# EAGLE design pwm (EAGLE 6.1)
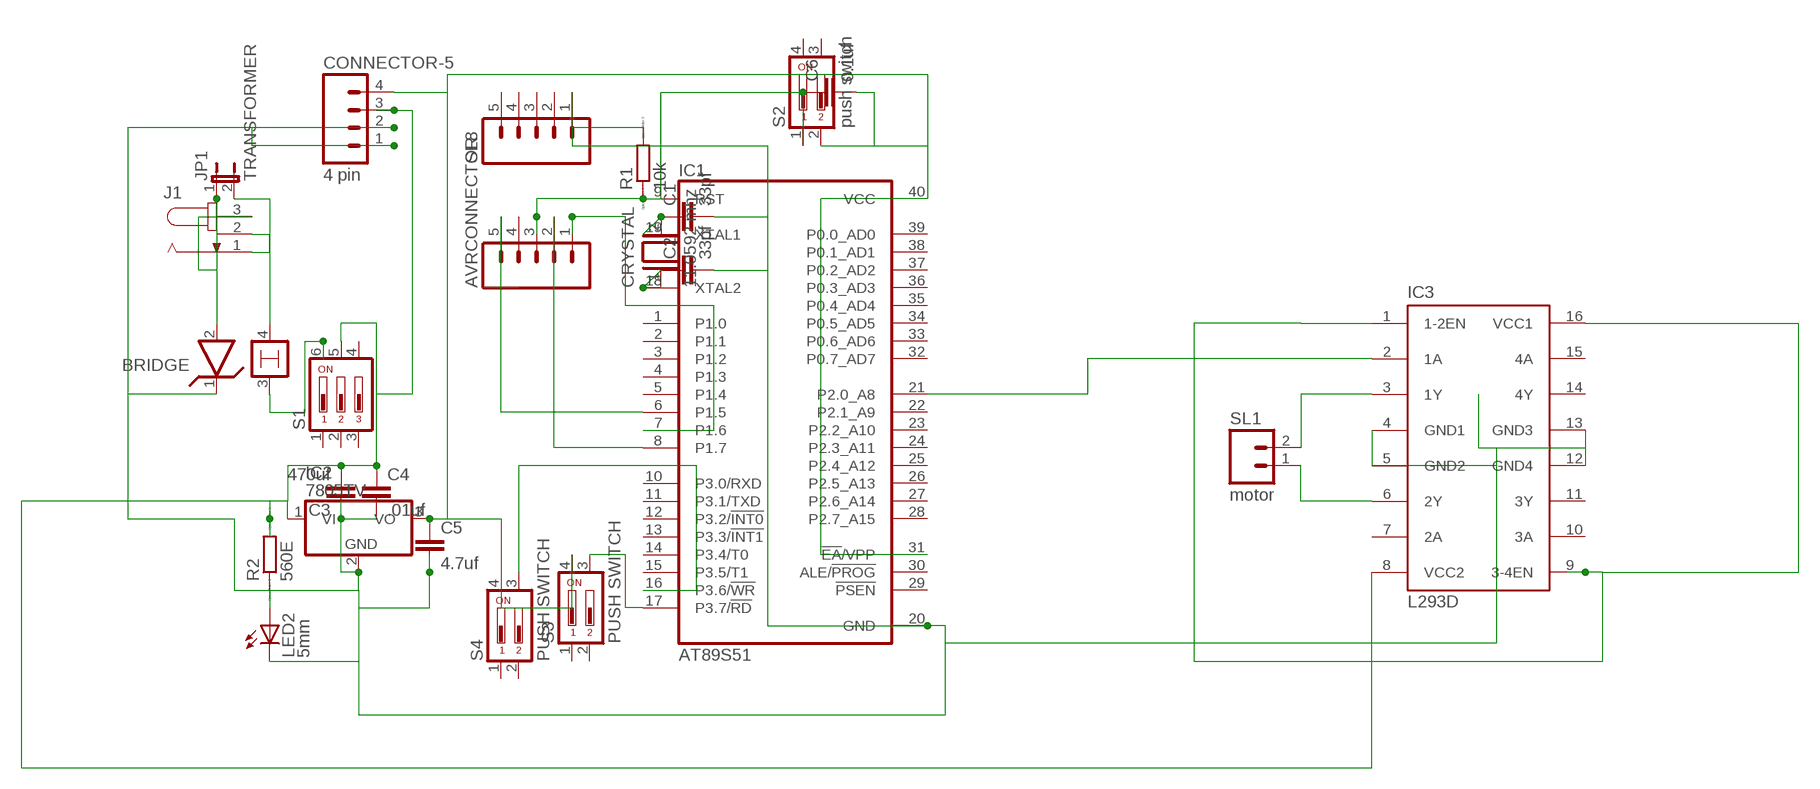
[diagram p0: schematic, sheet 1]

## Parts
AVRCONNECTOR  M05  [05P]
BRIDGE  LM399H  [TO39/4]
C1  33pf  C-EU025-024X044  [C025-024X044]
C2  33pf  C-EU025-024X044  [C025-024X044]
C3  470uf  C5/7.2  [C5B7.2]
C4  .01uf  C2,5-3  [C2.5-3]
C5  4.7uf  C2,5-3  [C2.5-3]
C6  0.1uf  C2,5-3  [C2.5-3]
CONNECTOR-5  4 pin  M04  [04P]
CRYSTAL  11.0592 mhz  XTAL/S  [QS]
IC1  AT89S51  AT89C51-12PC  [DIL40]
IC2  7805TV  [TO220V]
IC3  L293D  [DIL16]
J1  JACK-PLUG0  [SPC4077]
JP1  TRANSFORMER  JP1E  [JP1]
LED2  5mm  LED5MM  [LED5MM]
R1  10k  R0204/7  [0204/7]
R2  560E  R0204/7  [0204/7]
S1  DA03  [DA-03]
S2  push switch  DP02  [DP-02]
S3  PUSH SWITCH  DS02  [DS-02]
S4  PUSH SWITCH  DS02  [DS-02]
SL1  motor  M02  [02P]
SL8  M05  [05P]

## Nets
N$1: C2.1 CRYSTAL.1 IC1.18(XTAL2)
N$2: C1.1 CRYSTAL.2 IC1.19(XTAL1)
N$3: IC1.17(P3.7/!RD) S3.3
N$4: C3.2 C4.1 CONNECTOR-5.3 IC2.1(VI) IC3.8(VCC2) R2.2 S1.5
N$5: BRIDGE.2 J1.3 JP1.1
N$6: IC3.6(2Y) SL1.1
N$7: IC3.3(1Y) SL1.2
N$8: BRIDGE.1 CONNECTOR-5.1 CONNECTOR-5.2
N$9: IC1.16(P3.6/!WR) S4.3
N$14: AVRCONNECTOR.3 C6.1 IC1.9(RST) R1.1 S2.1
N$15: AVRCONNECTOR.1 IC1.7(P1.6)
N$16: BRIDGE.4 J1.1 J1.2 JP1.2
N$21: C1.2 C2.2 C3.1 C4.2 C5.2 IC1.20(GND) IC2.2(GND) IC3.4(GND1) IC3.5(GND2) IC3.12(GND4) IC3.13(GND3) LED2.K(C) R1.2 SL8.1
N$22: IC3.1(1-2EN) IC3.9(3-4EN) IC3.16(VCC1)
N$30: IC1.21(P2.0_A8) IC3.2(1A)
N$39: C5.1 C6.2 CONNECTOR-5.4 IC1.31(!EA!/VPP) IC1.40(VCC) IC2.3(VO) S2.2 S3.4 S4.4
N$42: AVRCONNECTOR.5 IC1.6(P1.5)
N$43: LED2.A R2.1
N$45: AVRCONNECTOR.2 IC1.8(P1.7)
N$47: BRIDGE.3 S1.6
Unconnected: AVRCONNECTOR.4 IC1.1(P1.0) IC1.2(P1.1) IC1.3(P1.2) IC1.4(P1.3) IC1.5(P1.4) IC1.10(P3.0/RXD) IC1.11(P3.1/TXD) IC1.12(P3.2/!INT0) IC1.13(P3.3/!INT1) IC1.14(P3.4/T0) IC1.15(P3.5/T1) IC1.22(P2.1_A9) IC1.23(P2.2_A10) IC1.24(P2.3_A11) IC1.25(P2.4_A12) IC1.26(P2.5_A13) IC1.27(P2.6_A14) IC1.28(P2.7_A15) IC1.29(!PSEN) IC1.30(ALE/!PROG) IC1.32(P0.7_AD7) IC1.33(P0.6_AD6) IC1.34(P0.5_AD5) IC1.35(P0.4_AD4) IC1.36(P0.3_AD3) IC1.37(P0.2_AD2) IC1.38(P0.1_AD1) IC1.39(P0.0_AD0) IC3.7(2A) IC3.10(3A) IC3.11(3Y) IC3.14(4Y) IC3.15(4A) S1.1 S1.2 S1.3 S1.4 S2.3 S2.4 S3.1 S3.2 S4.1 S4.2 SL8.2 SL8.3 SL8.4 SL8.5

## Library data of the parts
AVRCONNECTOR SL8 = con-amp-quick:M05: AMP QUICK CONNECTOR; OC_FARNELL: unknown; OC_NEWARK: unknown
BRIDGE = linear:LM399H: Precision Z DIODE
C1 C2 = rcl:C-EU: CAPACITOR, European symbol
C3-C6 = capacitor-wima:C: CAPACITOR naming: grid - package width
CONNECTOR-5 = con-amp-quick:M04: AMP QUICK CONNECTOR; OC_FARNELL: unknown; OC_NEWARK: unknown
CRYSTAL = special:XTAL/S: CRYSTAL
IC1 = atmel:AT89C51-*: 8-bit Microcontroller with 4K Bytes Flash Not Recommended for New Designs. Use AT89S51. Source: http://www.atmel.com/dyn/resources/prod_documents/doc0265.; OC_FARNELL: unknown; OC_NEWARK: unknown
IC2 = linear:78*: Positive VOLTAGE REGULATOR Source: http://cache.national.com/ds/LM/LM78L05.pdf http://www.fairchildsemi.com/ds/LM/LM7805.pdf
IC3 = st-microelectronics:L293D: PUSH-PULL 4 CHANNEL DRIVER; MPN: L293D; OC_FARNELL: 9589619; OC_NEWARK: 56P8249
J1 = con-jack:JACK-PLUG: DC POWER JACK Power Jack, DC, Right Angle, Through Hole, Rated 5A at 16VDC, PC Terminals Distributor: Farnell (www.Farnell.de) Drawing: 84N1161.pdf / 84N1162.pdf Manufacturer: SPC Technology (www.spctechnology.com) Type: SPC4077 / SPC 4078; OC_FARNELL: unknown; OC_NEWARK: unknown
JP1 = jumper:JP1E: JUMPER
LED2 = led:LED: LED OSRAM: - CHIPLED LG R971, LG N971, LY N971, LG Q971, LY Q971, LO R971, LY R971 LH N974, LH R974 LS Q976, LO Q976, LY Q976 LO Q996 - Hyper CHIPLED LW Q18S LB Q993, LB Q99A, LB R99A - SideLED LS A670, LO A670, LY A670, LG A670, LP A670 LB A673, LV A673, LT A673, LW A673 LH A674 LY A675 LS A676, LA A676, LO A676, LY A676, LW A676 LS A679, LY A679, LG A679 - Hyper Micro SIDELED® LS Y876, LA Y876, LO Y876, LY Y876 LT Y87S - SmartLED LW L88C, LW L88S LB L89C, LB L89S, LG L890 LS L89K, LO L89K, LY L89K LS L896, LA L896, LO L896, LY L896 - TOPLED LS T670, LO T670, LY T670, LG T670, LP T670 LSG T670, LSP T670, LSY T670, LOP T670, LYG T670 LG T671, LOG T671, LSG T671 LB T673, LV T673, LT T673, LW T673 LH T674 LS T676, LA T676, LO T676, LY T676, LB T676, LH T676, LSB T676, LW T676 LB T67C, LV T67C, LT T67C, LS T67K, LO T67K, LY T67K, LW E67C LS E67B, LA E67B, LO E67B, LY E67B, LB E67C, LV E67C, LT E67C LW T67C LS T679, LY T679, LG T679 LS T770, LO T770, LY T770, LG T770, LP T770 LB T773, LV T773, LT T773, LW T773 LH T774 LS E675, LA E675, LY E675, LS T675 LS T776, LA T776, LO T776, LY T776, LB T776 LHGB T686 LT T68C, LB T68C - Hyper Mini TOPLED® LB M676 - Mini TOPLED Santana® LG M470 LS M47K, LO M47K, LY M47K Source: http://www.osram.convergy.de LUXEON: - LUMILED® LXK2-PW12-R00, LXK2-PW12-S00, LXK2-PW14-U00, LXK2-PW14-V00 LXK2-PM12-R00, LXK2-PM12-S00, LXK2-PM14-U00 LXK2-PE12-Q00, LXK2-PE12-R00, LXK2-PE12-S00, LXK2-PE14-T00, LXK2-PE14-U00 LXK2-PB12-K00, LXK2-PB12-L00, LXK2-PB12-M00, LXK2-PB14-N00, LXK2-PB14-P00, LXK2-PB14-Q00 LXK2-PR12-L00, LXK2-PR12-M00, LXK2-PR14-Q00, LXK2-PR14-R00 LXK2-PD12-Q00, LXK2-PD12-R00, LXK2-PD12-S00 LXK2-PH12-R00, LXK2-PH12-S00 LXK2-PL12-P00, LXK2-PL12-Q00, LXK2-PL12-R00 Source: www.luxeon.com KINGBRIGHT: KA-3528ASYC Source: www.kingbright.com
R1 R2 = eagle-ltspice:R: RESISTOR, European symbol; SPICEMODEL: NONE; SPICEPREFIX: R
S1 = switch-dil:DA03: DIL/CODE SWITCH; MPN: MCDA03; OC_FARNELL: 1521999; OC_NEWARK: 74M2972
S2 = switch-dil:DP02: DIL/CODE SWITCH; MPN: MCDP02; OC_FARNELL: 1255233; OC_NEWARK: 26M1095
S3 S4 = switch-dil:DS02: DIL/CODE SWITCH; OC_FARNELL: 9472126; OC_NEWARK: unknown
SL1 = con-amp-quick:M02: AMP QUICK CONNECTOR; OC_FARNELL: unknown; OC_NEWARK: unknown

## Board
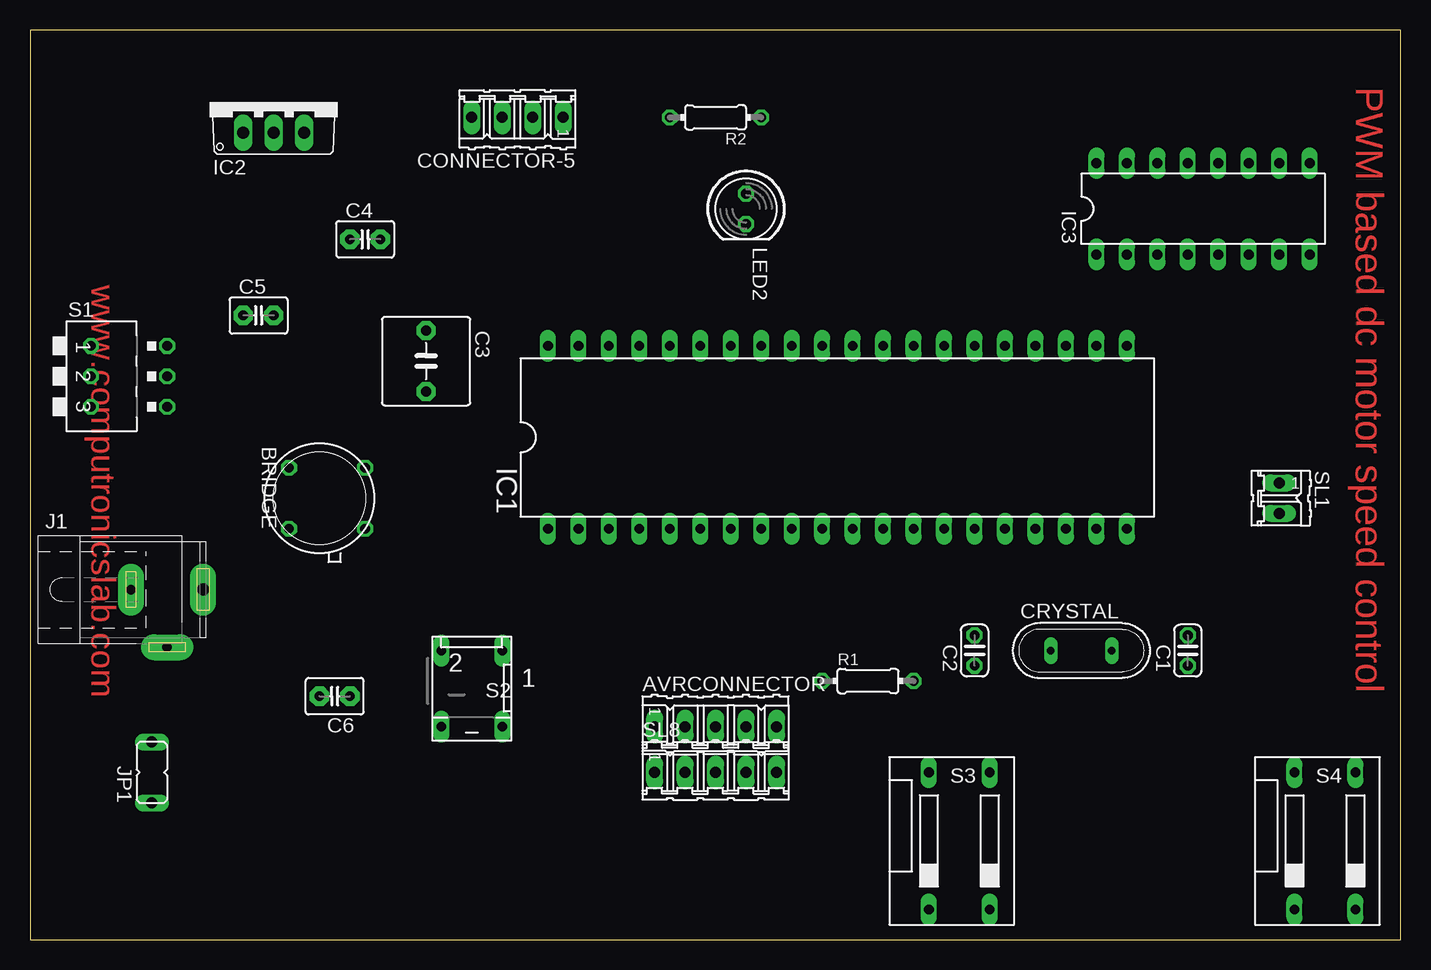
[diagram p1: board, top side]
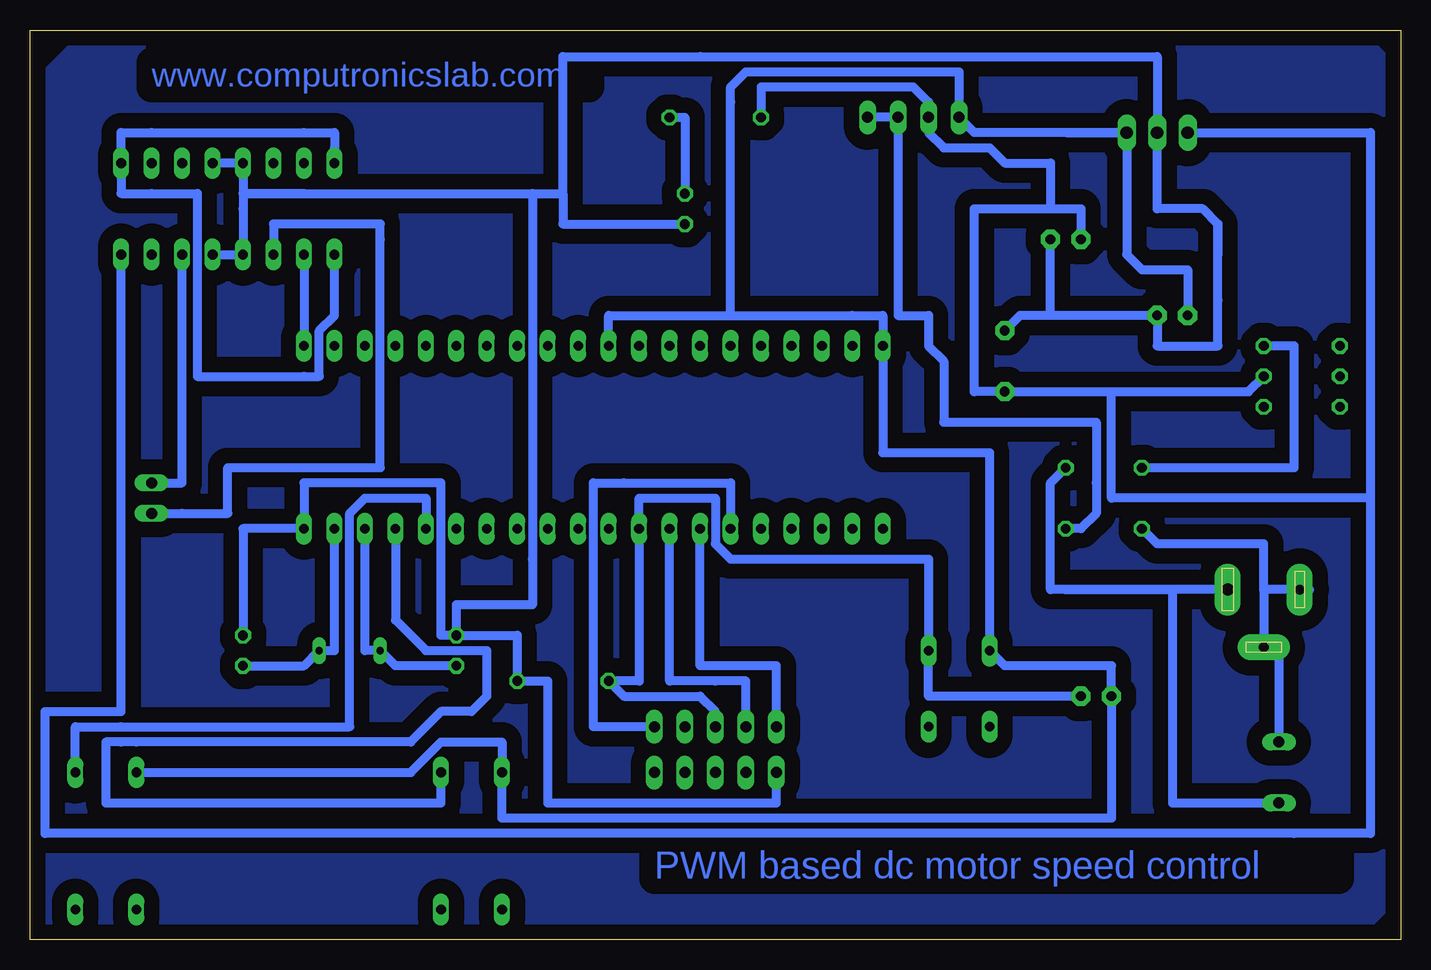
[diagram p2: board, bottom side, seen from below]

Size 114.28 x 75.87 mm. Coordinates in mm from the lower left corner, seen from the top.
Outline: 0,0 114.28,0 114.28,75.87 0,75.87 0,0
Copper layers (1*16): Top 0.035mm / dielectric 1.5mm / Bottom 0.035mm
Design rules: minimum track width 30mil, minimum drill 24mil, track to track 8mil, track to pad 8mil, pad to pad 8mil, via to via 8mil, smd to smd 8mil, copper to edge 40mil, drill to drill 8mil, minimum pad ring 10mil, minimum via ring 8mil, stop-mask expansion 4mil, vias tented up to drill 0mil, thermal gap 10mil

### Footprints (pad centres in the part's own frame; a part is rotated, then mirrored left to right if it is on the bottom)
05P = drill 0.914 long: 1 -5.08,0; 2 -2.54,0; 3 0,0; 4 2.54,0; 5 5.08,0
TO39/4 = drill 0.813 octagon: 1 -2.54,-2.54; 2 2.54,-2.54; 3 2.54,3.81; 4 -2.54,3.81
C025-024X044 = drill 0.813 octagon: 1 -1.27,0; 2 1.27,0
C5B7.2 = drill 0.813 pad 1.6 octagon: 1 -2.54,0; 2 2.54,0
C2.5-3 = drill 0.813 pad 1.6 octagon: 1 -1.27,0; 2 1.27,0
04P = drill 0.914 long: 1 -3.81,0; 2 -1.27,0; 3 1.27,0; 4 3.81,0
QS = drill 0.61 long: 1 -2.54,0; 2 2.54,0
DIL40 = drill 0.813 long: 1 -24.13,-7.62; 2 -21.59,-7.62; 3 -19.05,-7.62; 4 -16.51,-7.62; 5 -13.97,-7.62; 6 -11.43,-7.62; 7 -8.89,-7.62; 8 -6.35,-7.62; 9 -3.81,-7.62; 10 -1.27,-7.62; 11 1.27,-7.62; 12 3.81,-7.62; 13 6.35,-7.62; 14 8.89,-7.62; 15 11.43,-7.62; 16 13.97,-7.62; 17 16.51,-7.62; 18 19.05,-7.62; 19 21.59,-7.62; 20 24.13,-7.62; 21 24.13,7.62; 22 21.59,7.62; 23 19.05,7.62; 24 16.51,7.62; 25 13.97,7.62; 26 11.43,7.62; 27 8.89,7.62; 28 6.35,7.62; 29 3.81,7.62; 30 1.27,7.62; 31 -1.27,7.62; 32 -3.81,7.62; 33 -6.35,7.62; 34 -8.89,7.62; 35 -11.43,7.62; 36 -13.97,7.62; 37 -16.51,7.62; 38 -19.05,7.62; 39 -21.59,7.62; 40 -24.13,7.62
TO220V = drill 1.016 long: 1 -2.54,-2.54; 2 0,-2.54; 3 2.54,-2.54
DIL16 = drill 0.813 long: 1 -8.89,-3.81; 2 -6.35,-3.81; 3 -3.81,-3.81; 4 -1.27,-3.81; 5 1.27,-3.81; 6 3.81,-3.81; 7 6.35,-3.81; 8 8.89,-3.81; 9 8.89,3.81; 10 6.35,3.81; 11 3.81,3.81; 12 1.27,3.81; 13 -1.27,3.81; 14 -3.81,3.81; 15 -6.35,3.81; 16 -8.89,3.81
SPC4077 = drill 0.8 pad 2.184 long: 1 -3,0; 2 0,-4.8 | drill 1 pad 2.184 long: 3 3,0
JP1 = drill 0.914 long: 1 0,-2.54; 2 0,2.54
LED5MM = drill 0.813 octagon: A -1.27,0; K 1.27,0
0204/7 = drill 0.813 octagon: 1 -3.81,0; 2 3.81,0
DA-03 = drill 0.813 octagon: 1 -2.54,-5.08; 2 0,-5.08; 3 2.54,-5.08; 4 2.54,1.27; 5 0,1.27; 6 -2.54,1.27
DP-02 = drill 0.813 long: 1 -2.54,-2.54; 2 2.54,-2.54; 3 2.54,3.81; 4 -2.54,3.81
DS-02 = drill 0.813 long: 1 -5.08,-5.08; 2 0,-5.08; 3 0,6.35; 4 -5.08,6.35
02P = drill 0.914 long: 1 -1.27,0; 2 1.27,0

### Placement (x,y rotation side)
AVRCONNECTOR  57.15,17.78 0 top
BRIDGE  25.4,36.83 90 top
C1  96.52,24.13 90 top
C2  78.74,24.13 90 top
C3  33.02,48.26 270 top
C4  27.94,58.42 0 top
C5  19.05,52.07 0 top
C6  25.4,20.32 180 top
CONNECTOR-5  40.64,68.58 180 top
CRYSTAL  87.63,24.13 0 top
IC1  67.31,41.91 0 top
IC2  20.32,69.85 0 top
IC3  97.79,60.96 0 top
J1  11.43,29.21 0 top
JP1  10.16,13.97 0 top
LED2  59.69,60.96 270 top
R1  69.85,21.59 0 top
R2  57.15,68.58 180 top
S1  10.16,46.99 270 top
S2  36.83,21.59 180 top
S3  80.01,7.62 0 top
S4  110.49,7.62 0 top
SL1  104.14,36.83 270 top
SL8  57.15,13.97 0 top

### Tracks (layer width: path | path; a pad name or v marks a point on that pad's centre or on a via)
N$1
  Bottom 0.762: C2.1 83.82,22.86 CRYSTAL.1 86.36,24.13 IC1.18
N$2
  Bottom 0.762: C1.1 91.44,22.86 CRYSTAL.2 88.9,24.13 IC1.19
N$3
  Bottom 0.762: S3.3 80.01,11.43 82.55,11.43 105.41,11.43 106.68,11.43 107.95,11.43 107.95,13.97 107.95,16.51 106.68,16.51 105.41,16.51 82.55,16.51 80.01,19.05 77.47,19.05 76.2,20.32 76.2,24.13 77.47,24.13 81.28,24.13 83.82,26.67 IC1.17
N$4
  Bottom 0.762: R2.2 53.34,71.12 40.64,71.12 39.37,69.85 CONNECTOR-5.3 39.37,67.31 38.1,66.04 34.29,66.04 33.02,64.77 29.21,64.77 29.21,60.96 | 29.21,60.96 26.67,60.96 C4.1 | S1.5 12.7,45.72 24.13,45.72 | 24.13,45.72 C3.2 35.56,45.72 35.56,48.26 35.56,54.61 35.56,60.96 29.21,60.96 | IC3.8 106.68,19.05 107.95,19.05 113.03,19.05 113.03,15.24 113.03,8.89 8.89,8.89 2.54,8.89 2.54,11.43 2.54,22.86 2.54,36.83 | 2.54,36.83 2.54,67.31 IC2.1 | 24.13,45.72 24.13,36.83 2.54,36.83
N$5
  Bottom 0.762: BRIDGE.2 29.21,38.1 29.21,29.21 27.94,29.21 | 27.94,29.21 15.24,29.21 J1.3 | 27.94,29.21 19.05,29.21 19.05,11.43 JP1.1
N$6
  Bottom 0.762: IC3.6 101.6,38.1 SL1.1
N$7
  Bottom 0.762: IC3.3 93.98,59.69 91.44,59.69 88.9,59.69 87.63,59.69 85.09,59.69 85.09,58.42 85.09,39.37 97.79,39.37 97.79,35.56 101.6,35.56 SL1.2
N$8
  Bottom 0.762: BRIDGE.1 26.67,34.29 25.4,35.56 25.4,38.1 25.4,43.18 33.02,43.18 38.1,43.18 38.1,48.26 39.37,49.53 39.37,52.07 41.91,52.07 CONNECTOR-5.2 CONNECTOR-5.1
N$9
  Bottom 0.762: IC1.16 81.28,36.83 83.82,36.83 86.36,36.83 87.63,35.56 87.63,17.78 106.68,17.78 110.49,17.78 S4.3
N$10
  pour Bottom (isolate 1.27, no thermals): 10.16,0 3.81,0 0,3.81 0,72.39 3.81,76.2 109.22,76.2 114.3,71.12 114.3,2.54 111.76,0
N$14
  Bottom 0.762: C6.1 35.56,20.32 39.37,20.32 S2.1 39.37,29.21 39.37,31.75 46.99,31.75 55.88,31.75 57.15,33.02 57.15,36.83 63.5,36.83 IC1.9 63.5,21.59 R1.1 64.77,20.32 58.42,20.32 57.15,19.05 AVRCONNECTOR.3
N$15
  Bottom 0.762: IC1.7 58.42,22.86 55.88,22.86 52.07,22.86 52.07,21.59 52.07,19.05 AVRCONNECTOR.1
N$16
  Bottom 0.762: JP1.2 10.16,24.13 11.43,24.13 J1.2 11.43,25.4 11.43,29.21 | BRIDGE.4 20.32,33.02 12.7,33.02 11.43,33.02 11.43,29.21 | 11.43,29.21 8.89,29.21 J1.1 7.62,29.21 11.43,29.21
N$21
  Bottom 0.762: C1.2 96.52,34.29 IC1.20 91.44,38.1 87.63,38.1 82.55,38.1 80.01,38.1 80.01,35.56 80.01,25.4 C2.2 | C2.2 73.66,25.4 R1.2 71.12,21.59 71.12,11.43 63.5,11.43 52.07,11.43 SL8.1 | 15.24,57.15 15.24,59.69 | 15.24,59.69 16.51,60.96 20.32,60.96 IC2.2 20.32,73.66 58.42,73.66 69.85,73.66 69.85,62.23 | 15.24,57.15 15.24,53.34 15.24,49.53 20.32,49.53 C5.2 29.21,52.07 | 15.24,57.15 15.24,59.69 | 15.24,59.69 15.24,57.15 | C3.1 31.75,52.07 29.21,52.07 | 29.21,52.07 C4.2 | IC3.5 IC3.4 96.52,60.96 96.52,62.23 | LED2.K 69.85,59.69 69.85,62.23 | 91.44,62.23 93.98,62.23 96.52,62.23 | 91.44,62.23 72.39,62.23 | 72.39,62.23 69.85,62.23 | 96.52,62.23 IC3.13 IC3.12 | 91.44,62.23 96.52,62.23 | C2.2 78.74,27.94 76.2,27.94 72.39,27.94 72.39,31.75 72.39,62.23
N$22
  Bottom 0.762: IC3.1 88.9,52.07 90.17,50.8 90.17,46.99 91.44,46.99 100.33,46.99 100.33,55.88 100.33,62.23 104.14,62.23 106.68,62.23 IC3.9 106.68,67.31 104.14,67.31 91.44,67.31 88.9,67.31 88.9,66.04 IC3.16
N$30
  Bottom 0.762: IC3.2 IC1.21
N$39
  Bottom 0.762: IC2.3 27.94,67.31 | 27.94,67.31 35.56,67.31 CONNECTOR-5.4 36.83,72.39 52.07,72.39 54.61,72.39 55.88,71.12 55.88,69.85 55.88,52.07 | 27.94,67.31 IC2.3 | IC2.3 22.86,57.15 21.59,55.88 17.78,55.88 C5.1 | S4.4 82.55,13.97 80.01,16.51 77.47,16.51 74.93,16.51 S3.4 74.93,10.16 71.12,10.16 34.29,10.16 24.13,10.16 24.13,13.97 C6.2 24.13,22.86 26.67,22.86 33.02,22.86 S2.2 34.29,40.64 43.18,40.64 IC1.40 43.18,52.07 45.72,52.07 55.88,52.07 | 55.88,52.07 66.04,52.07 IC1.31
N$42
  Bottom 0.762: IC1.6 55.88,38.1 64.77,38.1 67.31,38.1 67.31,35.56 67.31,17.78 AVRCONNECTOR.5
N$43
  Bottom 0.762: LED2.A 59.69,68.58 R2.1
N$45
  Bottom 0.762: IC1.8 60.96,21.59 57.15,21.59 54.61,21.59 54.61,20.32 54.61,19.05 AVRCONNECTOR.2
N$47
  Bottom 0.762: S1.6 8.89,49.53 8.89,39.37 BRIDGE.3

### Text on the board
Top: PWM based dc motor speed control | www.computronicslab.com
Bottom: www.computronicslab.com | PWM based dc motor speed control